# EAGLE design XPDR_Board_1 (EAGLE 7.2.0)
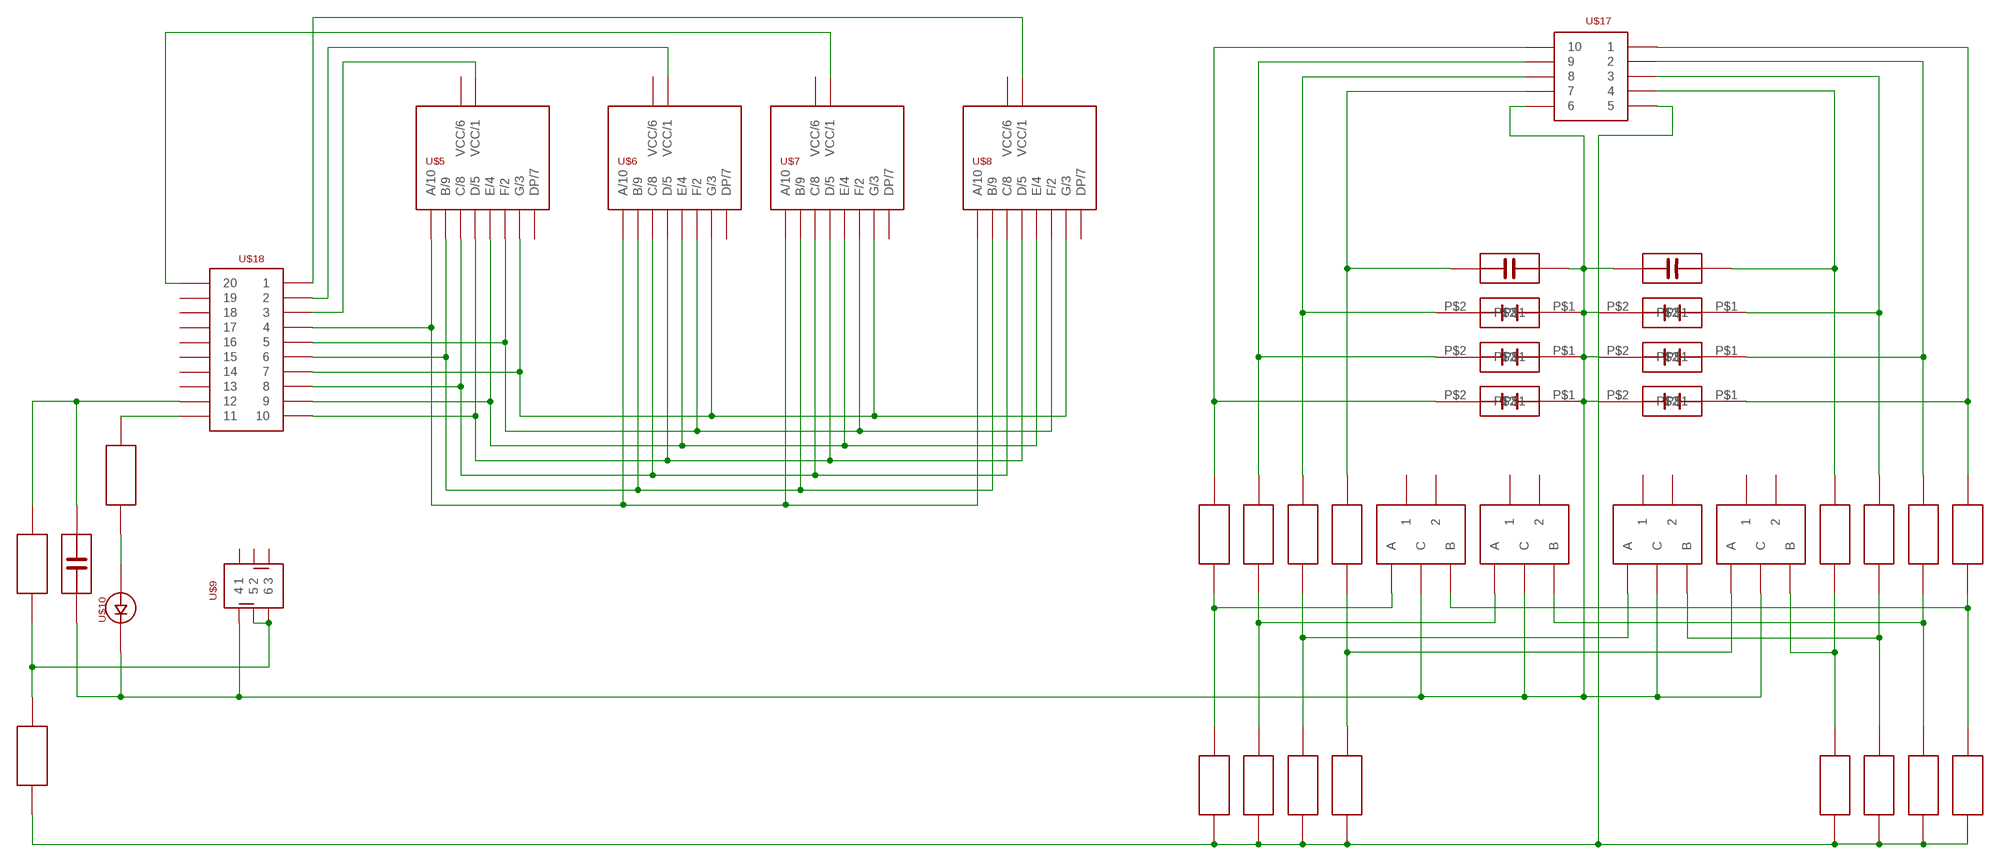
[diagram p0: schematic, sheet 1]

## Parts
U$1  PEC11R  [PEC11R]
U$2  PEC11R  [PEC11R]
U$3  PEC11R  [PEC11R]
U$4  PEC11R  [PEC11R]
U$5  SA3611EWA  [SA3611EWA]
U$6  SA3611EWA  [SA3611EWA]
U$7  SA3611EWA  [SA3611EWA]
U$8  SA3611EWA  [SA3611EWA]
U$9  P1-0S  [P1-0S]
U$10  LED_5MM  [LED_5MM]
U$11  REZISTOR  [REZISTOR]
U$12  REZISTOR  [REZISTOR]
U$13  REZISTOR  [REZISTOR]
U$14  REZISTOR  [REZISTOR]
U$15  REZISTOR  [REZISTOR]
U$16  REZISTOR  [REZISTOR]
U$17  LISTA_2X5  [LISTA_2X5]
U$18  LISTA_2X10  [LISTA_2X10]
U$19  REZISTOR  [REZISTOR]
U$20  REZISTOR  [REZISTOR]
U$21  REZISTOR  [REZISTOR]
U$22  REZISTOR  [REZISTOR]
U$23  REZISTOR  [REZISTOR]
U$24  REZISTOR  [REZISTOR]
U$25  REZISTOR  [REZISTOR]
U$26  REZISTOR  [REZISTOR]
U$27  REZISTOR  [REZISTOR]
U$28  REZISTOR  [REZISTOR]
U$29  KONDENZATOR_SIROKY  [KONDENZATOR_SIROKY]
U$30  REZISTOR  [REZISTOR]
U$31  REZISTOR  [REZISTOR]
U$32  KONDENZATOR_SIROKY  [KONDENZATOR_SIROKY]
U$33  KONDENZATOR_SIROKY  [KONDENZATOR_SIROKY]
U$34  KONDENZATOR  [KONDENZATOR]
U$35  KONDENZATOR_SIROKY  [KONDENZATOR_SIROKY]
U$36  KONDENZATOR_SIROKY  [KONDENZATOR_SIROKY]
U$37  KONDENZATOR_SIROKY  [KONDENZATOR_SIROKY]
U$38  KONDENZATOR  [KONDENZATOR]
U$39  KONDENZATOR  [KONDENZATOR]
U$40  REZISTOR  [REZISTOR]

## Nets
N$1: U$5.10(A/10) U$6.10(A/10) U$7.10(A/10) U$8.10(A/10) U$18.4
N$2: U$5.9(B/9) U$6.9(B/9) U$7.9(B/9) U$8.9(B/9) U$18.6
N$3: U$5.8(C/8) U$6.8(C/8) U$7.8(C/8) U$8.8(C/8) U$18.8
N$4: U$5.5(D/5) U$6.5(D/5) U$7.5(D/5) U$8.5(D/5) U$18.10
N$5: U$11.P$2 U$17.10 U$29.P$2
N$6: U$5.2(F/2) U$6.2(F/2) U$7.2(F/2) U$8.2(F/2) U$18.5
N$7: U$5.3(G/3) U$6.3(G/3) U$7.3(G/3) U$8.3(G/3) U$18.7
N$8: U$1.B U$12.P$1 U$27.P$1
N$9: U$5.4(E/4) U$6.4(E/4) U$7.4(E/4) U$8.4(E/4) U$18.9
N$10: U$13.P$2 U$17.9 U$32.P$2
N$11: U$2.B U$14.P$1 U$25.P$1
N$12: U$15.P$2 U$17.8 U$33.P$2
N$13: U$3.B U$16.P$1 U$23.P$1
N$14: U$17.7 U$19.P$2 U$34.P$2
N$15: U$4.B U$20.P$1 U$21.P$1
N$16: U$5.1(VCC/1) U$18.3
N$17: U$6.1(VCC/1) U$18.2
N$18: U$7.1(VCC/1) U$18.20
N$19: U$8.1(VCC/1) U$18.1
N$20: U$9.5 U$9.6 U$30.P$2 U$31.P$1
N$21: U$1.C U$2.C U$3.C U$4.C U$9.4 U$10.P$2 U$17.6 U$29.P$1 U$32.P$1 U$33.P$1 U$34.P$1 U$35.P$2 U$36.P$2 U$37.P$2 U$38.P$2 U$39.P$2
N$22: U$1.A U$11.P$1 U$28.P$1
N$23: U$12.P$2 U$17.1 U$35.P$1
N$24: U$17.5 U$21.P$2 U$22.P$2 U$23.P$2 U$24.P$2 U$25.P$2 U$26.P$2 U$27.P$2 U$28.P$2 U$31.P$2
N$25: U$3.A U$15.P$1 U$24.P$1
N$26: U$18.11 U$40.P$1
N$27: U$4.A U$19.P$1 U$22.P$1
N$28: U$14.P$2 U$17.2 U$36.P$1
N$29: U$16.P$2 U$17.3 U$37.P$1
N$30: U$17.4 U$20.P$2 U$38.P$1
N$31: U$2.A U$13.P$1 U$26.P$1
N$32: U$10.P$1 U$40.P$2
N$33: U$18.12 U$30.P$1 U$39.P$1
Unconnected: U$1.1 U$1.2 U$2.1 U$2.2 U$3.1 U$3.2 U$4.1 U$4.2 U$5.6(VCC/6) U$5.7(DP/7) U$6.6(VCC/6) U$6.7(DP/7) U$7.6(VCC/6) U$7.7(DP/7) U$8.6(VCC/6) U$8.7(DP/7) U$9.1 U$9.2 U$9.3 U$18.13 U$18.14 U$18.15 U$18.16 U$18.17 U$18.18 U$18.19

## Library data of the parts
U$1-U$4 = RadioStack_v2:PEC11R
U$5-U$8 = RadioStack_v2:SA3611EWA
U$9 = RadioStack_v2:P1-0S
U$10 = RadioStack_v2:LED_5MM
U$11-U$16 U$19-U$28 U$30 U$31 U$40 = RadioStack_v2:REZISTOR
U$17 = RadioStack_v2:LISTA_2X5
U$18 = RadioStack_v2:LISTA_2X10
U$29 U$32 U$33 U$35-U$37 = RadioStack_v2:KONDENZATOR_SIROKY
U$34 U$38 U$39 = RadioStack_v2:KONDENZATOR

## Board
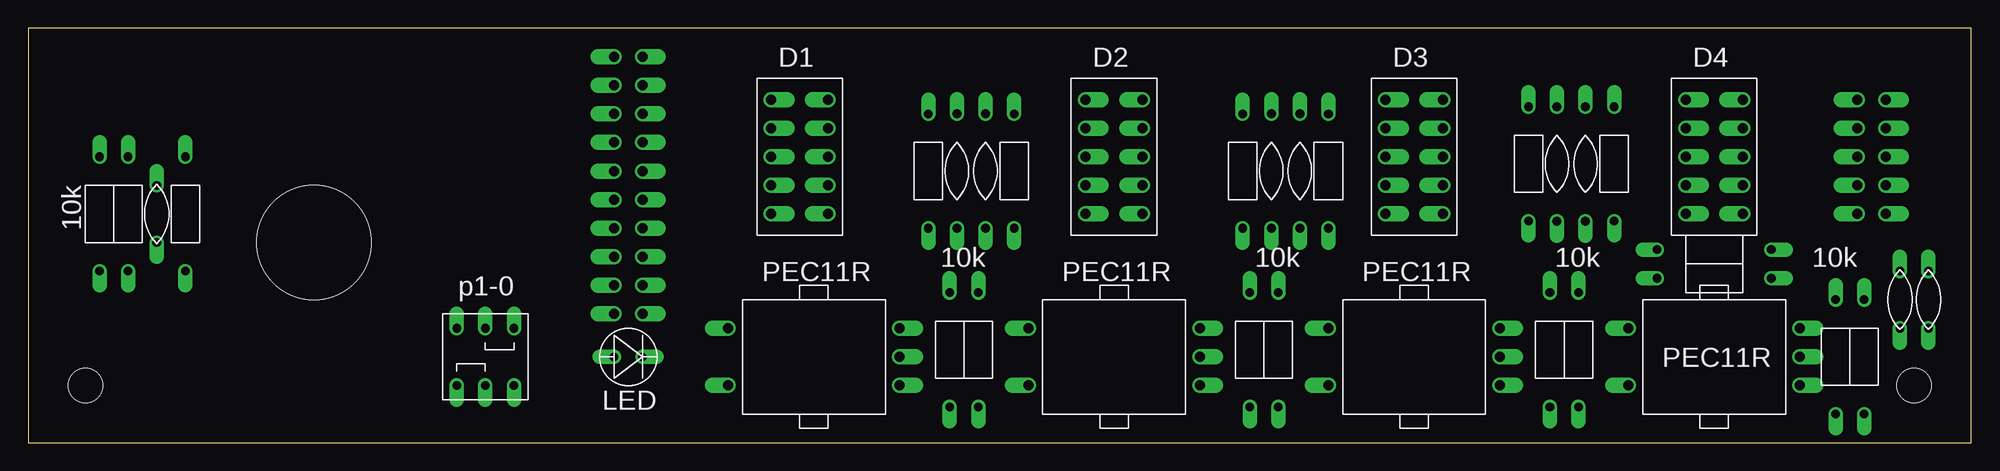
[diagram p1: board, top side]
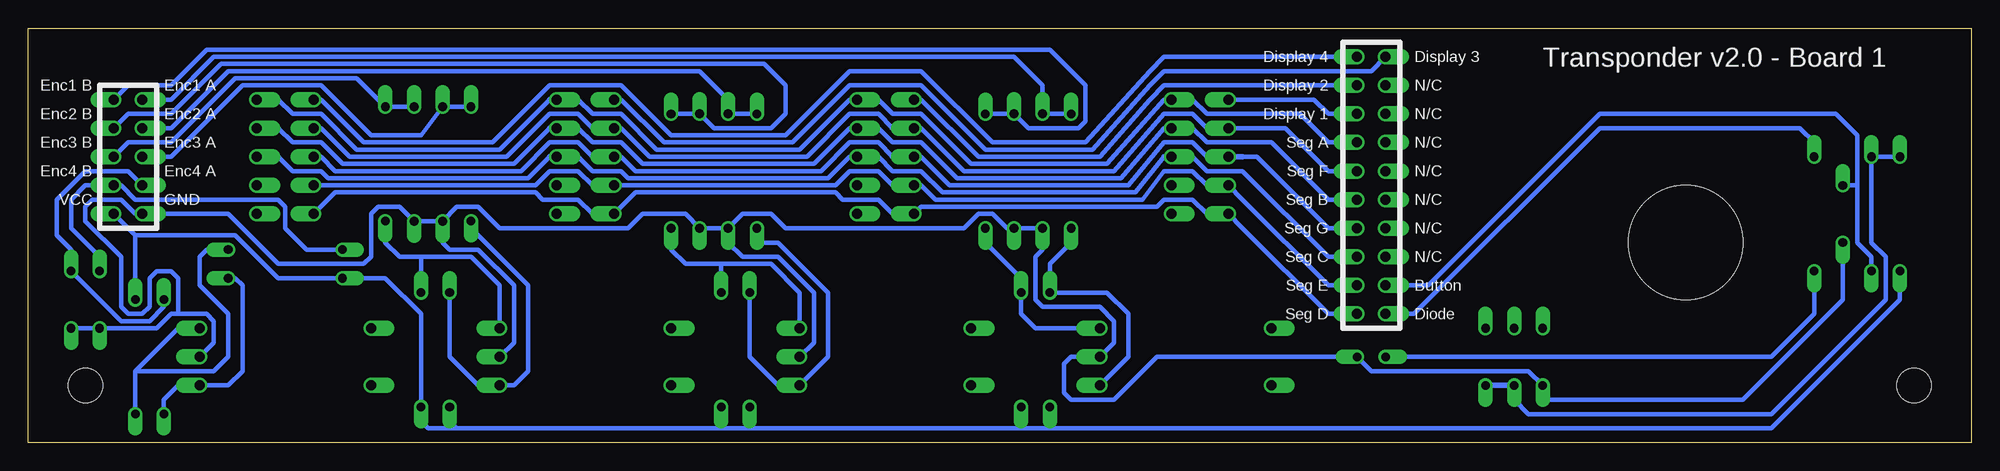
[diagram p2: board, bottom side, seen from below]

Size 172.72 x 36.83 mm. Coordinates in mm from the lower left corner, seen from the top.
Outline: 0,36.83 0,0 172.72,0 172.72,36.83 0,36.83
Copper layers (1*16): Top 0.035mm / dielectric 1.5mm / Bottom 0.035mm
Design rules "RadioStack_v2": minimum track width 0.2mm, minimum drill 0.4mm, track to track 0.2mm, track to pad 0.2mm, pad to pad 0.2mm, via to via 0.2mm, smd to smd 0.2mm, copper to edge 0.5mm, drill to drill 8mil, minimum pad ring 10mil, minimum via ring 8mil, stop-mask expansion 4mil, vias tented up to drill 0mil, thermal gap 10mil
Holes 10.16 mm at 25.4,17.78
Holes 3.05 mm at 5.08,5.08 167.64,5.08

### Footprints (pad centres in the part's own frame; a part is rotated, then mirrored left to right if it is on the bottom)
PEC11R = drill 0.889 pad 1.27 offset: 1 0,15.24; 2 5.08,15.24; A 0,0; B 5.08,0; C 2.54,0
SA3611EWA = drill 0.889 pad 1.27 offset: 1 0,0; 2 0,-2.54; 3 0,-5.08; 4 0,-7.62; 5 0,-10.16; 6 5.08,-10.16; 7 5.08,-7.62; 8 5.08,-5.08; 9 5.08,-2.54; 10 5.08,0
P1-0S = drill 0.762 pad 1.27 offset: 1 0,0; 2 2.54,0; 3 5.08,0; 4 0,-5.08; 5 2.54,-5.08; 6 5.08,-5.08
LED_5MM = drill 0.762 pad 1.27 offset: P$1 2.54,0; P$2 0,0
REZISTOR = drill 0.762 pad 1.27 offset: P$1 -5.08,0; P$2 5.08,0
LISTA_2X5 = drill 0.889 pad 1.27 offset: 1 0,0; 2 0,-2.54; 3 0,-5.08; 4 0,-7.62; 5 0,-10.16; 6 2.54,-10.16; 7 2.54,-7.62; 8 2.54,-5.08; 9 2.54,-2.54; 10 2.54,0
LISTA_2X10 = drill 0.889 pad 1.27 offset: 1 0,0; 2 0,-2.54; 3 0,-5.08; 4 0,-7.62; 5 0,-10.16; 6 0,-12.7; 7 0,-15.24; 8 0,-17.78; 9 0,-20.32; 10 0,-22.86; 11 2.54,-22.86; 12 2.54,-20.32; 13 2.54,-17.78; 14 2.54,-15.24; 15 2.54,-12.7; 16 2.54,-10.16; 17 2.54,-7.62; 18 2.54,-5.08; 19 2.54,-2.54; 20 2.54,0
KONDENZATOR_SIROKY = drill 0.8 offset: P$1 5.08,0; P$2 -5.08,0
KONDENZATOR = drill 0.762 pad 1.27 offset: P$1 -2.54,0; P$2 2.54,0

### Placement (x,y rotation side)
U$1  77.47,5.08 90 top
U$2  104.14,5.08 90 top
U$3  130.81,5.08 90 top
U$4  157.48,5.08 90 top
U$5  66.04,30.48 0 top
U$6  93.98,30.48 0 top
U$7  120.65,30.48 0 top
U$8  147.32,30.48 0 top
U$9  38.1,10.16 0 top
U$10  54.61,7.62 180 top
U$11  80.01,24.13 90 top
U$12  87.63,24.13 90 top
U$13  107.95,24.13 90 top
U$14  115.57,24.13 90 top
U$15  133.35,24.77 90 top
U$16  140.97,24.77 90 top
U$17  165.1,30.48 0 bottom
U$18  54.61,34.29 0 bottom
U$19  160.66,7.62 90 top
U$20  149.86,17.14 180 top
U$21  163.19,7.62 90 top
U$22  149.86,14.6 180 top
U$23  137.79,8.25 270 top
U$24  135.25,8.25 270 top
U$25  111.12,8.25 270 top
U$26  108.58,8.25 270 top
U$27  84.45,8.25 270 top
U$28  81.92,8.25 270 top
U$29  82.55,24.13 270 top
U$30  8.89,20.32 90 top
U$31  6.35,20.32 270 top
U$32  110.49,24.13 270 top
U$33  135.89,24.77 270 top
U$34  168.91,12.7 90 top
U$35  85.09,24.13 90 top
U$36  113.03,24.13 90 top
U$37  138.43,24.77 90 top
U$38  166.37,12.7 270 top
U$39  11.43,20.32 270 top
U$40  13.97,20.32 270 top

### Tracks (layer width: path | path; a pad name or v marks a point on that pad's centre or on a via)
N$1
  Bottom 0.406: U$7.10 123.83,30.48 122.56,29.21 120.02,29.21 116.84,26.03 104.14,26.03 99.69,30.48 U$6.10 97.16,30.48 95.89,29.21 93.34,29.21 88.9,24.77 76.83,24.77 71.75,30.48 U$5.10 69.22,30.48 67.94,29.21 59.69,29.21 57.15,26.67 U$18.4 | 126.36,30.48 130.81,26.03 143.51,26.03 146.69,29.21 149.22,29.21 150.5,30.48
  Bottom 0.508: U$7.10 126.36,30.48 | 150.5,30.48 U$8.10
N$2
  Bottom 0.406: U$7.9 123.83,27.94 122.56,26.67 120.02,26.67 118.11,24.77 102.87,24.77 99.69,27.94 U$6.9 97.16,27.94 95.89,26.67 93.34,26.67 90.17,23.49 75.56,23.49 71.75,27.94 U$5.9 69.22,27.94 67.94,26.67 63.5,26.67 62.23,26.67 57.15,21.59 U$18.6 | 126.36,27.94 129.54,24.77 144.78,24.77 146.69,26.67 149.22,26.67 150.5,27.94
  Bottom 0.508: U$7.9 126.36,27.94 | 150.5,27.94 U$8.9
N$3
  Bottom 0.406: 71.75,25.4 74.3,22.22 91.44,22.22 93.34,24.13 95.89,24.13 97.16,25.4 U$6.8 99.69,25.4 101.6,23.49 119.38,23.49 120.02,24.13 122.56,24.13 123.83,25.4 U$7.8 | 126.36,25.4 128.27,23.49 146.05,23.49 146.69,24.13 149.22,24.13 150.5,25.4 | U$5.8 69.22,25.4 67.94,24.13 64.77,24.13 57.15,16.51 U$18.8
  Bottom 0.508: U$7.8 126.36,25.4 | 150.5,25.4 U$8.8 | U$5.8 71.75,25.4
N$4
  Bottom 0.406: U$8.5 145.41,22.22 127.64,22.22 127,21.59 123.83,21.59 122.56,20.32 U$7.5 118.75,22.22 100.97,22.22 100.33,21.59 97.16,21.59 95.89,20.32 U$6.5 93.34,20.95 72.39,20.95 71.75,21.59 69.22,21.59 67.94,20.32 U$5.5 64.77,19.05 57.15,11.43 U$18.10
N$5
  Bottom 0.406: U$11.P$2 U$29.P$2 82.55,31.75 85.09,34.29 156.21,34.29 160.02,30.48 U$17.10
N$6
  Bottom 0.406: U$6.2 93.34,27.94 89.53,24.13 76.2,24.13 71.75,29.21 69.22,29.21 67.94,27.94 U$5.2 60.96,27.94 57.15,24.13 U$18.5 | 95.89,27.94 97.16,29.21 99.69,29.21 103.5,25.4 117.47,25.4 120.02,27.94 U$7.2 122.56,27.94 123.83,29.21 126.36,29.21 130.18,25.4 144.15,25.4 146.69,27.94 U$8.2
  Bottom 0.508: U$6.2 95.89,27.94
N$7
  Bottom 0.406: 67.94,25.4 69.22,26.67 71.75,26.67 74.93,22.86 90.81,22.86 93.34,25.4 U$6.3 | 95.89,25.4 97.16,26.67 99.69,26.67 102.23,24.13 118.75,24.13 120.02,25.4 U$7.3 122.56,25.4 123.83,26.67 126.36,26.67 128.91,24.13 145.41,24.13 146.69,25.4 U$8.3 | U$18.7 57.15,19.05 63.5,25.4 64.77,25.4
  Bottom 0.508: 67.94,25.4 U$5.3 64.77,25.4 | U$6.3 95.89,25.4
N$8
  Bottom 0.406: U$1.B 83.19,10.16 84.45,11.43 U$27.P$1 84.45,14.6 87.63,17.78 U$12.P$1
N$9
  Bottom 0.406: U$8.4 127.64,22.86 126.36,24.13 123.83,24.13 122.56,22.86 U$7.4 100.97,22.86 99.69,24.13 97.16,24.13 95.89,22.86 U$6.4 93.34,22.86 92.08,21.59 73.66,21.59 71.75,24.13 69.22,24.13 67.94,22.86 U$5.4 64.77,21.59 57.15,13.97 U$18.9
N$10
  Bottom 0.406: U$13.P$2 U$32.P$2 110.49,30.48 113.03,33.02 154.94,33.02 160.02,27.94 U$17.9
N$11
  Bottom 0.406: U$2.B 104.14,13.33 106.68,15.88 111.12,15.88 | 111.12,15.88 114.3,15.88 115.57,17.14 U$14.P$1 | U$25.P$1 111.12,15.88
N$12
  Bottom 0.406: U$15.P$2 U$33.P$2 137.79,27.3 142.24,27.3 146.69,31.75 153.67,31.75 160.02,25.4 U$17.8
N$13
  Bottom 0.406: U$3.B 130.81,13.97 133.35,16.51 137.79,16.51 | 137.79,16.51 139.7,16.51 140.97,17.78 U$16.P$1 | U$23.P$1 137.79,16.51
N$14
  Bottom 0.406: U$17.7 163.83,24.13 167.64,24.13 170.18,21.59 170.18,18.41 168.91,17.14 U$34.P$2 164.47,10.79 161.93,10.79 160.66,12.06 U$19.P$2
N$15
  Bottom 0.406: U$4.B 159.38,10.16 163.19,6.35 | 163.19,6.35 U$21.P$1 | U$20.P$1 156.84,17.14 157.48,16.51 157.48,13.97 154.94,11.43 154.94,7.62 156.21,6.35 163.19,6.35
N$16
  Bottom 0.406: U$5.1 58.42,30.48 57.15,29.21 U$18.3
N$17
  Bottom 0.406: U$6.1 93.34,30.48 88.27,25.4 77.47,25.4 73.03,30.48 71.75,31.75 U$18.2
N$18
  Bottom 0.406: U$7.1 120.02,30.48 116.2,26.67 104.78,26.67 99.69,31.75 93.34,31.75 87.63,26.03 78.11,26.03 73.03,31.75 71.75,33.02 53.34,33.02 U$18.20
N$19
  Bottom 0.406: U$8.1 146.69,30.48 142.88,26.67 131.44,26.67 126.36,31.75 120.02,31.75 115.57,27.3 105.41,27.3 99.69,33.02 93.34,33.02 87,26.67 78.74,26.67 73.03,33.02 71.75,34.29 U$18.1
N$20
  Bottom 0.406: U$31.P$1 U$30.P$2 8.89,17.78 7.62,16.51 7.62,12.7 17.78,2.54 39.37,2.54 40.64,3.81 U$9.5
  Bottom 0.508: U$9.5 U$9.6
N$21
  Bottom 0.406: U$2.C 102.87,8.89 102.87,13.33 106.05,16.51 109.22,16.51 110.49,17.78 U$32.P$1 | U$3.C 129.54,8.89 129.54,13.97 132.72,17.14 135.25,17.14 135.89,17.78 U$33.P$1 | U$34.P$1 U$38.P$2 161.29,10.16 160.02,11.43 159.38,11.43 | 159.38,11.43 156.84,11.43 156.21,10.79 156.21,8.89 U$4.C | 159.38,11.43 159.38,14.6 160.02,15.24 161.29,15.24 161.93,14.6 161.93,12.06 162.56,11.43 163.83,11.43 164.47,12.06 164.47,16.51 167.64,19.68 167.64,20.95 167,21.59 164.47,21.59 163.19,20.32 U$17.6 154.94,20.32 150.5,15.88 142.88,15.88 142.24,16.51 142.24,20.32 141.6,20.95 139.7,20.95 U$37.P$2 U$33.P$1 | U$32.P$1 U$36.P$2 114.3,20.32 118.11,20.32 119.38,19.05 130.81,19.05 132.72,20.95 134.62,20.95 U$33.P$1 | U$32.P$1 109.22,20.32 106.68,20.32 105.41,19.05 89.53,19.05 88.27,20.32 87,20.32 85.72,19.05 U$35.P$2 U$29.P$1 82.55,17.14 83.19,16.51 83.19,12.7 82.55,12.06 77.47,12.06 76.2,10.79 76.2,8.89 U$1.C 80.01,7.62 80.64,6.98 80.64,4.45 80.01,3.81 76.2,3.81 72.39,7.62 U$10.P$2 53.34,6.35 39.37,6.35 U$9.4 38.1,3.81 20.32,3.81 11.43,12.7 U$39.P$2
N$22
  Bottom 0.406: U$1.A 74.93,7.62 74.93,11.43 76.83,13.33 U$28.P$1 81.92,15.88 80.01,17.78 U$11.P$1
N$23
  Bottom 0.406: U$12.P$2 U$35.P$1 83.82,27.94 79.38,27.94 78.74,28.57 78.74,31.75 81.92,34.92 156.84,34.92 160.02,31.75 163.83,31.75 U$17.1
N$24
  Bottom 0.406: 163.19,18.41 154.31,18.41 150.5,14.6 U$22.P$2 140.97,14.6 137.79,11.43 U$23.P$2 137.79,1.91 137.16,1.27 134.62,1.27 | 163.19,18.41 U$21.P$2 | U$17.5 163.19,18.41 | 84.45,1.27 108.58,1.27 | 108.58,1.27 111.12,1.27 | 111.12,1.27 U$25.P$2 | U$24.P$2 135.25,1.91 134.62,1.27 | 134.62,1.27 111.12,1.27 | U$26.P$2 108.58,1.27 | U$31.P$2 6.35,12.7 17.78,1.27 81.92,1.27 | 81.92,1.27 U$28.P$2 | U$27.P$2 84.45,1.27 | 84.45,1.27 81.92,1.27
N$25
  Bottom 0.406: U$24.P$1 135.25,7.62 132.72,5.08 U$3.A 129.54,5.08 128.27,6.35 128.27,13.97 133.35,19.05 U$15.P$1
N$26
  Bottom 0.406: U$40.P$1 13.97,26.67 15.24,27.94 33.02,27.94 49.53,11.43 U$18.11
N$27
  Bottom 0.406: U$19.P$1 160.66,3.81 159.38,5.08 U$4.A 154.94,5.08 153.67,6.35 153.67,13.97 154.31,14.6 U$22.P$1
N$28
  Bottom 0.406: U$14.P$2 U$36.P$1 111.76,27.94 106.68,27.94 105.41,29.21 105.41,31.75 107.31,33.66 155.57,33.66 160.02,29.21 163.83,29.21 U$17.2
N$29
  Bottom 0.406: U$37.P$1 U$16.P$2 143.51,32.38 154.31,32.38 160.02,26.67 163.83,26.67 U$17.3
N$30
  Bottom 0.406: U$38.P$1 166.37,16.51 168.91,19.05 168.91,21.59 167.64,22.86 U$17.4 164.47,22.86 163.19,21.59 150.5,21.59 149.86,20.95 149.86,19.05 147.96,17.14 U$20.P$2
N$31
  Bottom 0.406: U$26.P$1 108.58,7.62 106.05,5.08 U$2.A 101.6,7.62 101.6,13.33 106.05,17.78 107.95,17.78 U$13.P$1
N$32
  Bottom 0.406: U$40.P$2 13.97,11.43 17.78,7.62 U$10.P$1
N$33
  Bottom 0.406: U$30.P$1 8.89,16.51 10.16,17.78 10.16,22.86 | U$39.P$1 10.16,22.86 | 10.16,22.86 10.16,27.3 12.06,29.21 33.02,29.21 48.26,13.97 U$18.12
N$34
  cutout Bottom (isolate 1.016): 1.27,35.56 171.45,35.56 171.45,1.27 1.27,1.27

### Text on the board
tPlace: D1 | D2 | D3 | D4 | 10k | 10k | 10k | 10k | 10k | PEC11R | PEC11R | PEC11R | p1-0 | PEC11R | LED
bPlace: Transponder v2.0 - Board 1 | Display 3 | Display 4 | N/C | Display 2 | Enc1 A | Enc1 B | N/C | Display 1 | Enc2 A | Enc2 B | N/C | Seg A | Enc3 A | Enc3 B | N/C | Seg F | Enc4 A | Enc4 B | N/C | Seg B | GND | VCC | N/C | Seg G | N/C | Seg C | Button | Seg E | Diode | Seg D